# EAGLE design fuzz (EAGLE 6.5.0)
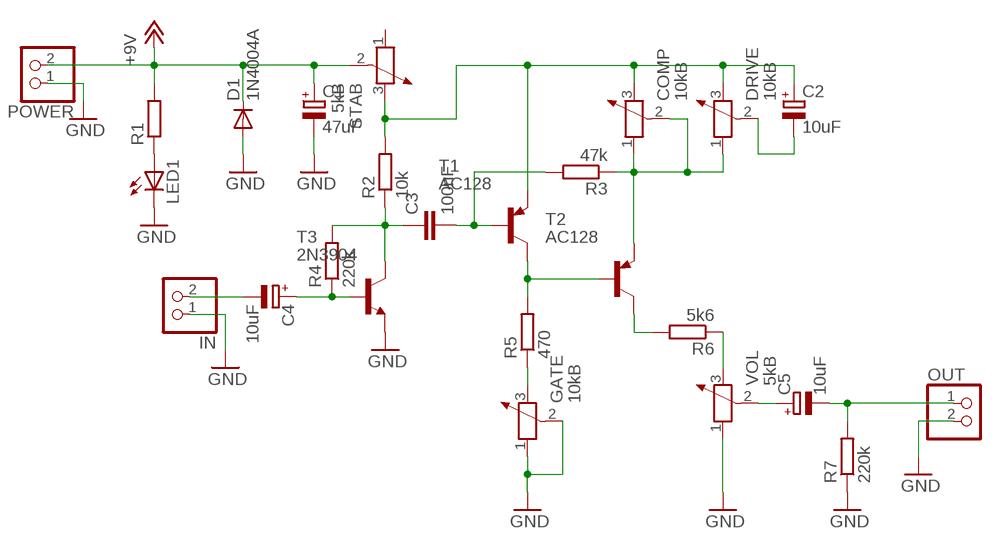
[diagram p0: schematic, sheet 1]

## Parts
C1  47uF  CPOL-EUE2.5-6  [E2,5-6]
C2  10uF  CPOL-EUE2.5-6  [E2,5-6]
C3  100nF  C-EU050-045X075  [C050-045X075]
C4  10uF  CPOL-EUE2.5-6  [E2,5-6]
C5  10uF  CPOL-EUE2.5-6  [E2,5-6]
COMP  10kB  POTENTIOMETER_  [1X03]
D1  1N4004A  [DO41-5]
DRIVE  10kB  POTENTIOMETER_  [1X03]
GATE  10kB  POTENTIOMETER_  [1X03]
IN  PINHD-1X2  [1X02]
LED1  LED3MM  [LED3MM]
OUT  PINHD-1X2  [1X02]
POWER  PINHD-1X2  [1X02]
R1  R-EU_  [R0805]
R2  10k  R-EU_0207/7  [0207/7]
R3  47k  R-EU_0207/7  [0207/7]
R4  220k  R-EU_0207/7  [0207/7]
R5  470  R-EU_0207/7  [0207/7]
R6  5k6  R-EU_0207/7  [0207/7]
R7  220k  R-EU_0207/7  [0207/7]
STAB  5kB  POTENTIOMETER_  [1X03]
T1  AC128  [TO18]
T2  AC128  [TO18]
T3  2N3904  [TO92]
VOL  5kB  POTENTIOMETER_  [1X03]

## Nets
+12V: C1.+ D1.C POWER.2 R1.2 STAB.2 ; supply symbol labelled +9V
GND: C1.- D1.A GATE.1 GATE.2 IN.1 LED1.K(C) OUT.2 POWER.1 R7.1 T3.3(E) VOL.1
N$1: LED1.A R1.1
N$2: C4.+ R4.1 T3.2(B)
N$3: C2.+ COMP.3 DRIVE.3 R2.2 STAB.3 T1.1(E)
N$4: C3.1 R2.1 R4.2 T3.1(C)
N$5: C3.2 R3.2 T1.2(B)
N$6: C2.- DRIVE.2
N$7: COMP.1 COMP.2 DRIVE.1 R3.1 T2.1(E)
N$8: R5.2 T1.3(C) T2.2(B)
N$9: GATE.3 R5.1
N$10: R6.2 T2.3(C)
N$11: R6.1 VOL.3
N$12: C5.+ VOL.2
N$13: C5.- OUT.1 R7.2
N$14: C4.- IN.2
Unconnected: STAB.1

## Library data of the parts
C1 C2 C4 C5 = fuzz:CPOL-EU: POLARIZED CAPACITOR, European symbol
C3 = fuzz:C-EU: CAPACITOR, European symbol
COMP DRIVE GATE STAB VOL = fuzz:POTENTIOMETER_: Potentiometer
D1 = fuzz:1N4004: DIODE general purpose rectifier, 1 A
IN OUT POWER = fuzz:PINHD-1X2: PIN HEADER
LED1 = fuzz:LED
R1-R7 = fuzz:R-EU_: RESISTOR, European symbol
T1 T2 = fuzz:AC128: PNP TRANSISTOR
T3 = fuzz:2N3904: NPN TRANSISTOR

## Board
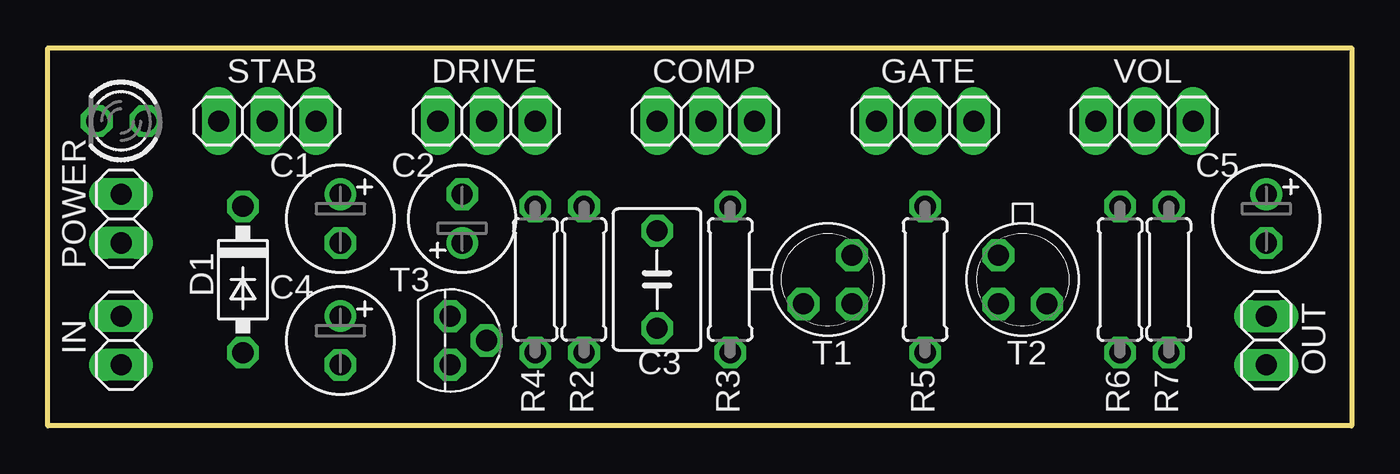
[diagram p1: board, top side]
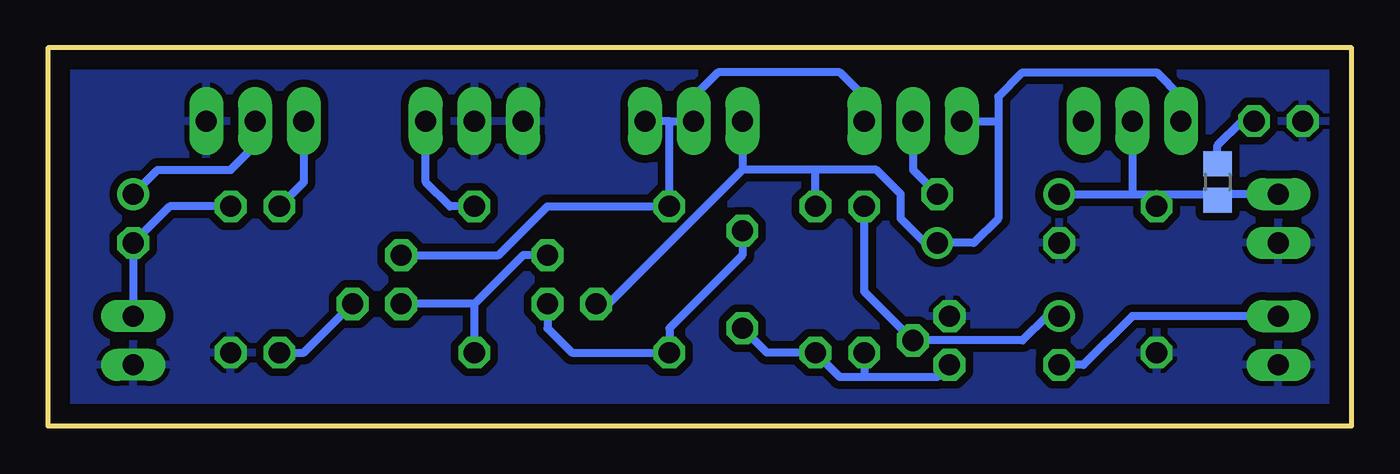
[diagram p2: board, bottom side, seen from below]

Size 67.94 x 19.68 mm. Coordinates in mm from the lower left corner, seen from the top.
Outline: 0,0 0,19.68 67.94,19.68 67.94,0 0,0
Copper layers (1*16): Top 0.035mm / dielectric 1.5mm / Bottom 0.035mm
Design rules "default": minimum track width 10mil, minimum drill 24mil, track to track 8mil, track to pad 8mil, pad to pad 8mil, via to via 8mil, smd to smd 8mil, copper to edge 40mil, drill to drill 8mil, minimum pad ring 10mil, minimum via ring 8mil, stop-mask expansion 4mil, vias tented up to drill 0mil, thermal gap 10mil

### Footprints (pad centres in the part's own frame; a part is rotated, then mirrored left to right if it is on the bottom)
E2,5-6 = drill 1.1: + -1.27,0 | drill 1.1 pad 1.6 octagon: - 1.27,0
C050-045X075 = drill 1.1 octagon: 1 -2.54,0; 2 2.54,0
1X03 = drill 1.1 pad 1.778 long: 1 -2.54,0; 2 0,0; 3 2.54,0
DO41-5 = drill 1.1 octagon: A 3.81,0; C -3.81,0
1X02 = drill 1.1 pad 1.676 long: 1 -1.27,0; 2 1.27,0
LED3MM = drill 1.1 octagon: A -1.27,0; K 1.27,0
R0805 = smd 1.3 x 1.5: 1 -0.95,0; 2 0.95,0
0207/7 = drill 1.1 octagon: 1 -3.81,0; 2 3.81,0
TO18 = drill 1.1 pad 1.676 octagon: 1 -1.27,-1.27; 2 1.27,-1.27; 3 1.27,1.27
TO92 = drill 1.1 pad 1.676 octagon: 1 1.27,0; 2 0,1.905; 3 -1.27,0

### Placement (x,y rotation side)
C1  15.24,10.79 270 top
C2  21.59,10.79 90 top
C3  31.75,7.62 90 top
C4  15.24,4.45 270 top
C5  63.5,10.79 270 top
COMP  34.29,15.88 180 top
D1  10.16,7.62 270 top
DRIVE  22.86,15.88 180 top
GATE  45.72,15.88 0 top
IN  3.81,4.45 90 top
LED1  3.81,15.88 180 top
OUT  63.5,4.45 270 top
POWER  3.81,10.79 90 top
R1  6.99,12.7 270 bottom
R2  27.94,7.62 90 top
R3  35.56,7.62 270 top
R4  25.4,7.62 270 top
R5  45.72,7.62 270 top
R6  5k1  [0207/7]  55.88,7.62 270 top
R7  58.42,7.62 90 top
STAB  11.43,15.88 180 top
T1  40.64,7.62 0 top
T2  50.8,7.62 270 top
T3  20.95,4.45 270 top
VOL  57.15,15.88 180 top

### Tracks (layer width: path | path; a pad name or v marks a point on that pad's centre or on a via)
+12V
  Bottom 0.406: STAB.2 11.43,12.06 | C1.+ 11.43,12.06 | POWER.2 6.67,12.06 R1.2 7.3,12.06 10.16,12.06 | D1.C 10.16,12.06 | 11.43,12.06 10.16,12.06
GND
  pour Bottom (isolate 0.406): -1.27,-1.27 -1.27,20.32 69.22,20.32 69.22,-1.27
N$1
  Bottom 0.406: LED1.A 5.71,15.88 6.99,14.61 R1.1
N$2
  Bottom 0.406: C4.+ 15.88,5.71 17.14,4.45 T3.2 25.4,6.99 R4.1
N$3
  Bottom 0.406: STAB.3 8.89,17.14 10.16,18.41 17.14,18.41 18.41,17.14 18.41,15.88 | 18.41,15.88 18.41,10.79 19.68,9.53 C2.+ 22.23,9.53 23.5,10.79 23.5,12.06 24.77,13.34 27.94,13.34 | DRIVE.3 18.41,15.88 | 27.94,13.34 31.75,13.34 | R2.2 27.94,13.34 | COMP.3 31.75,13.34 | 31.75,13.34 38.73,6.35 T1.1
N$4
  Bottom 0.406: T3.1 21.59,2.54 25.4,2.54 | 25.4,2.54 26.67,2.54 R2.1 30.48,3.81 C3.1 | R4.2 25.4,2.54
N$5
  Bottom 0.406: C3.2 31.75,8.89 35.56,5.08 R3.2 40.64,3.81 41.91,5.08 T1.2
N$6
  Bottom 0.406: DRIVE.2 22.86,13.34 C2.-
N$7
  Bottom 0.406: T2.1 44.45,8.89 41.91,11.43 R3.1 35.56,15.88 | 35.56,15.88 COMP.1 | 35.56,15.88 COMP.2 34.29,17.14 33.02,18.41 26.67,18.41 25.4,17.14 DRIVE.1
N$8
  Bottom 0.406: T1.3 43.18,8.89 45.72,6.35 | 45.72,6.35 T2.2 | R5.2 45.72,6.35
N$9
  Bottom 0.406: R5.1 46.99,11.43 48.26,12.7 GATE.3
N$10
  Bottom 0.406: R6.2 54.61,3.81 T2.3
N$11
  Bottom 0.406: VOL.3 54.61,12.7 R6.1
N$12
  Bottom 0.406: C5.+ 62.23,13.34 58.42,13.34 57.15,14.61 VOL.2
N$13
  Bottom 0.406: OUT.1 C5.- 61.59,11.43 R7.2
N$14
  Bottom 0.406: IN.2 11.43,5.71 13.97,3.17 C4.-